# Altium schematic sheet LCD_Display.SchDoc
size A4
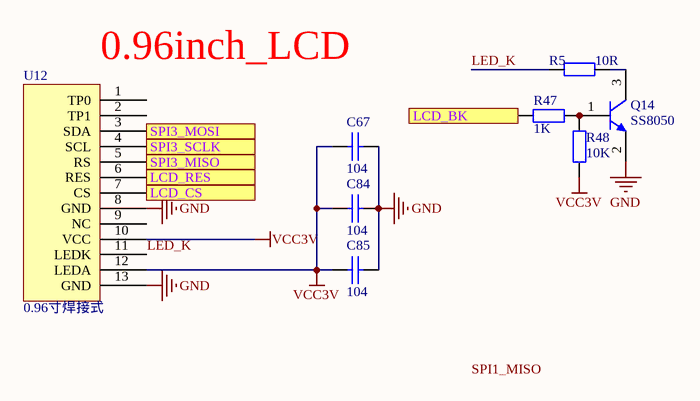
[diagram p0: LCD_Display.SchDoc]

## Parts
C67  value 104  [0402C]  (hidden comment: CAP)
C84  value 104  [0402C]  (hidden comment: CAP)
C85  value 104  [0402C]  (hidden comment: CAP)
Q14  SS8050  [SOT-23Q]
R5  10R  [0402R]
R47  value 1K  [0402R]  (hidden comment: Res1)
R48  value 10K  [0402R]  (hidden comment: Res1)
U12  0.96寸焊接式  [13PIN-LCD]

## Ports
LCD_BK, LCD_CS, LCD_RES, SPI3_MISO, SPI3_MOSI, SPI3_SCLK

## Nets
GND: C67.2 C84.2 C85.2 Q14.2(E) U12.8(GND) U12.13(GND)
VCC3V: C67.1 C84.1 C85.1 R48.1 U12.10(VCC) U12.12(LEDA)
LCD_BK: R47.1 ; port LCD_BK
LCD_CS: U12.7(CS) ; port LCD_CS
LCD_RES: U12.6(RES) ; port LCD_RES
LED_K: R5.1 U12.11(LEDK)
SPI3_MISO: U12.5(RS) ; port SPI3_MISO
SPI3_MOSI: U12.3(SDA) ; port SPI3_MOSI
SPI3_SCLK: U12.4(SCL) ; port SPI3_SCLK
NetQ14_1: Q14.1(B) R47.2 R48.2
NetQ14_3: Q14.3(C) R5.2

Not connected (* = marked no-connect by the designer): U12 1(TP0) 2(TP1) 9(NC)

## Notes on the sheet
- (near U12) 0.96inch_LCD
- Labels drawn without touching a wire or pin: SPI1_MISO

## Library data of the parts
Q14 = SS8050: NPN贴片三极管; Published: 8-Jun-2000; LatestRevisionDate: 15-Jan-2003; LatestRevisionNote: PCB Footprint 'BCY-W3/D4.7' replaced; DatasheetDocument: 1997; PackageDocument: Sep-1998; PackageReference: TO-92A; Publisher: Altium Limited; Code_JEDEC: TO-92A; ComponentLink1Description: Manufacturer Link; ComponentLink1URL: http://www.fairchildsemi.com/; ComponentLink2Description: Datasheet; ComponentLink2URL: http://www.fairchildsemi.com/ds/2N%2F2N3904.pdf
R5 = RES: Resistor
R47 R48 = Res1: 贴片电阻; Published: 8-Jun-2000; LatestRevisionDate: 17-Jul-2002; LatestRevisionNote: Re-released for DXP Platform.; PackageReference: AXIAL-0.4; Publisher: Altium Limited